# EAGLE schematic vaha (EAGLE 9.0.1)
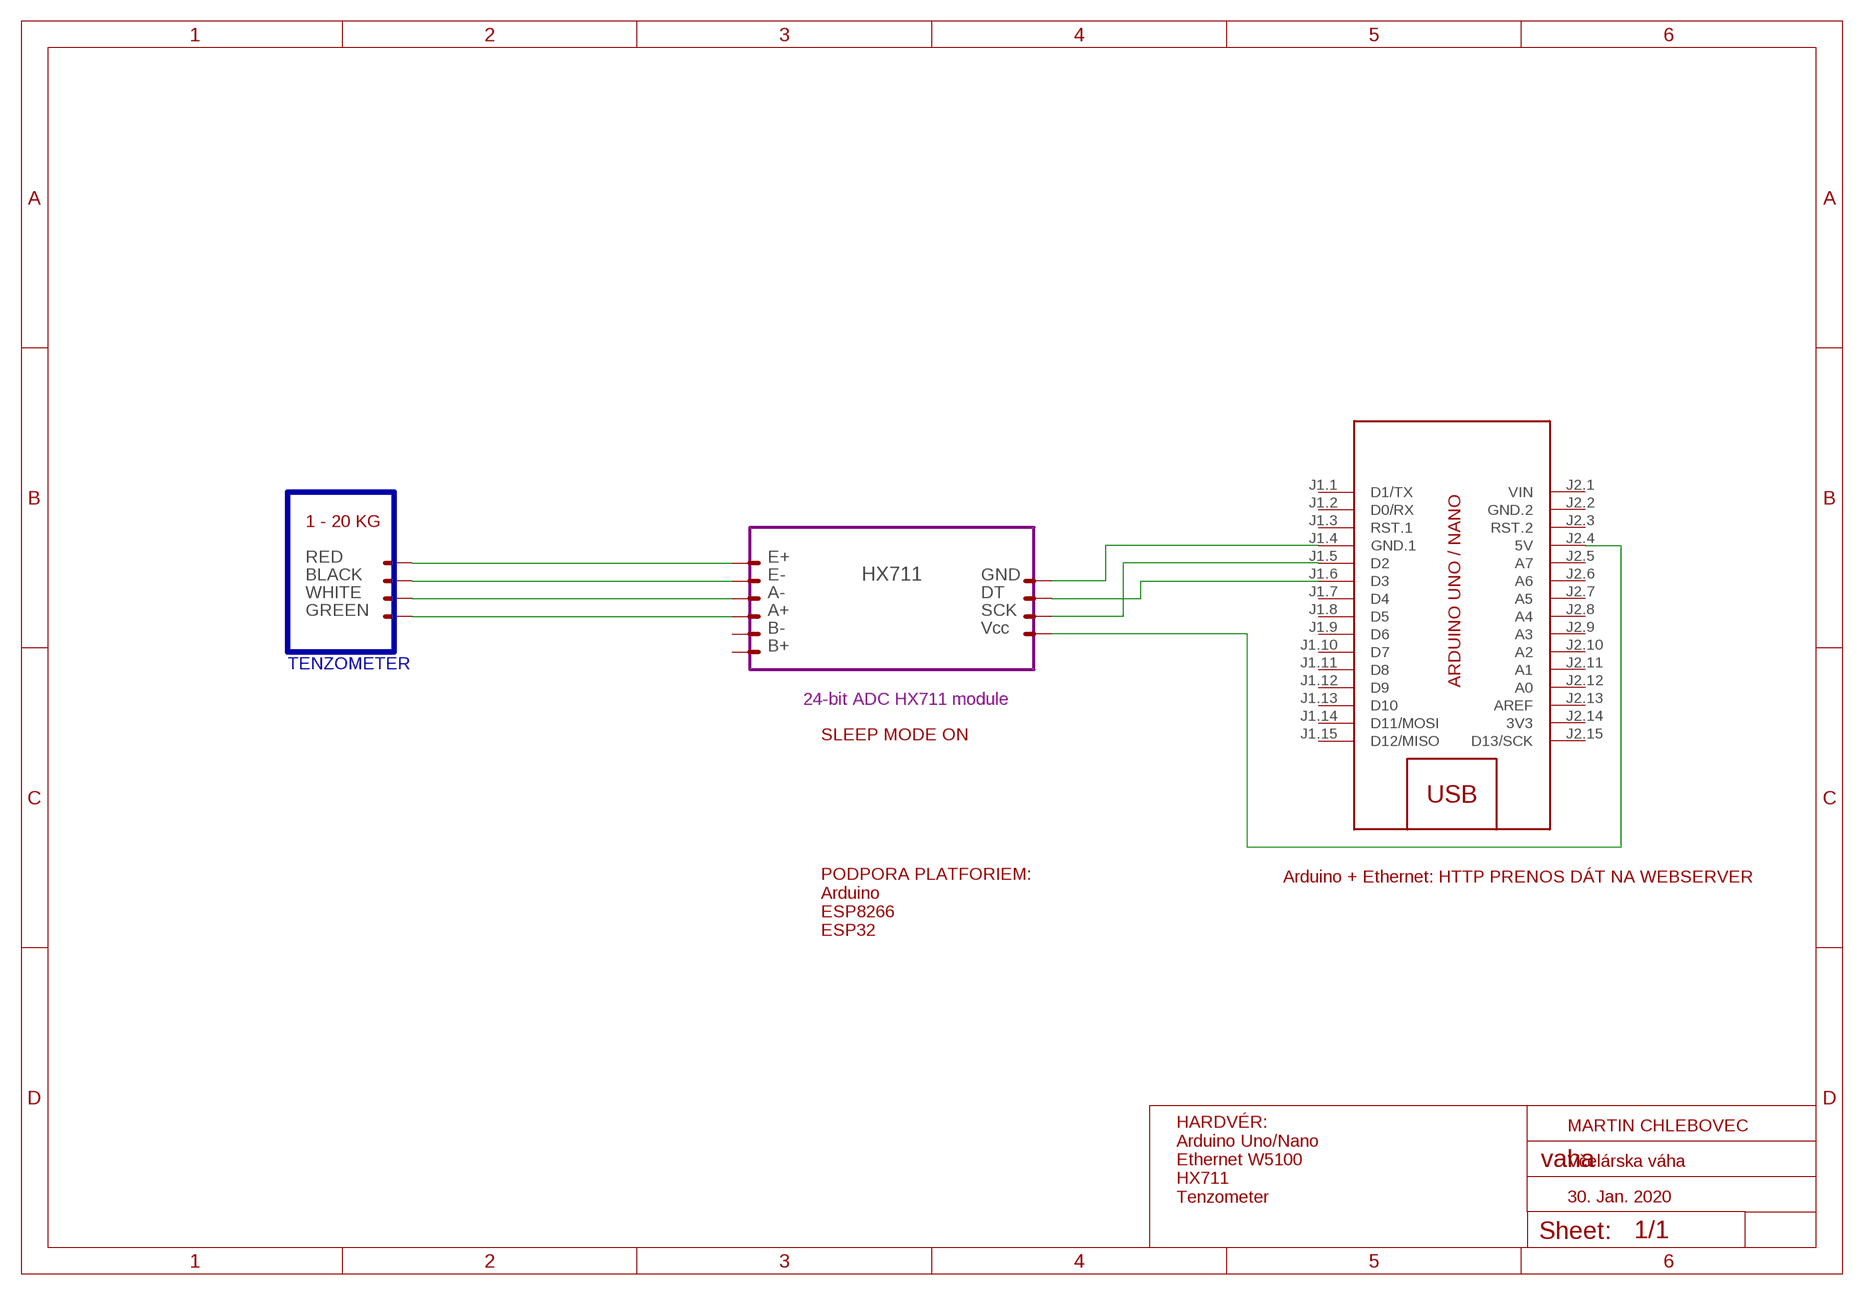
[diagram p0: schematic, sheet 1]

## Parts
M1  ARDUINO-NANO-3.0  [ARDUINO-NANO-3.0]
X1  332-02  [332-02]
X2  332-02  [332-02]
X3  332-02  [332-02]
X4  332-02  [332-02]
X5  332-02  [332-02]
X6  332-02  [332-02]
X7  332-02  [332-02]
X8  332-02  [332-02]
X9  332-02  [332-02]
X10  332-02  [332-02]
X11  332-02  [332-02]
X12  332-02  [332-02]
X13  332-02  [332-02]

## Module instances
HX711 = HX711

## Nets
N$1: M1.J1.5(D2) X2.2
N$2: M1.J1.6(D3) X1.2
N$3: M1.J1.4(GND.1) X1.1
N$4: M1.J2.4(5V) X3.2
N$5: X4.2 X10.2
N$6: X5.2 X11.2
N$7: X6.2 X12.2
N$8: X7.2 X13.2
Unconnected: M1.J1.1(D1/TX) M1.J1.2(D0/RX) M1.J1.3(RST.1) M1.J1.7(D4) M1.J1.8(D5) M1.J1.9(D6) M1.J1.10(D7) M1.J1.11(D8) M1.J1.12(D9) M1.J1.13(D10) M1.J1.14(D11/MOSI) M1.J1.15(D12/MISO) M1.J2.3(RST.2) M1.J2.5(A7) M1.J2.6(A6) M1.J2.7(A5) M1.J2.8(A4) M1.J2.9(A3) M1.J2.10(A2) M1.J2.11(A1) M1.J2.12(A0) M1.J2.13(AREF) M1.J2.15(D13/SCK) X2.1 X3.1 X4.1 X5.1 X6.1 X7.1 X8.1 X8.2 X9.1 X9.2 X10.1 X11.1 X12.1 X13.1

## Buses
B$1

## Notes on the sheet
- 1 - 20 KG
- RED | E+
- BLACK | E- | GND
- WHITE | A- | DT
- GREEN | A+ | SCK
- B- | Vcc
- B+
- TENZOMETER
- ARDUINO UNO / NANO
- 24-bit ADC HX711 module
- SLEEP MODE ON
- Arduino + Ethernet: HTTP PRENOS DÁT NA WEBSERVER
- PODPORA PLATFORIEM:
  Arduino
  ESP8266
  ESP32
- MARTIN CHLEBOVEC
- Včelárska váha
- HARDVÉR:
  Arduino Uno/Nano
  Ethernet W5100
  HX711
  Tenzometer
- 30. Jan. 2020

## Power pins joined to a net without a drawn wire
3V3: M1.J2.14(3V3)
GND.2: M1.J2.2(GND.2)
VIN: M1.J2.1(VIN)

## Library data of the parts
M1 = diy-modules:ARDUINO-NANO-3.0: Arduino Nano 3.0 and compatible devices More details available here: https://www.arduino.cc/en/Main/ArduinoBoardNano Click here to find device on ebay.com <http://www.ebay.com/sch/arduino+nano>
X1-X13 = con-garry:332-02: 2 Pin - 2mm Dual Row Source: www.mpe-connector.de / garry_shortform_2012.pdf

## Module HX711
Ports: 

### Library data of the parts